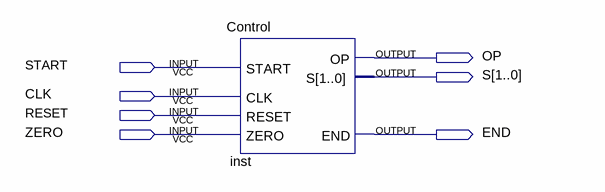
[diagram p0: schematic sheet]
// Quartus schematic congsobit1.bdf as structural Verilog: 1 symbols, 7 pins
module congsobit1 (
  input  START,
  input  CLK,
  input  RESET,
  input  ZERO,
  output OP,
  output [1:0] S,
  output END
);

  Control inst (.START(START), .ZERO(ZERO), .CLK(CLK), .RESET(RESET), .S(S), .END(END), .OP(OP));
endmodule
